# Altium schematic sheet CP_Scheme.SchDoc: Название платы
size 594 x 420 mm; ApprovedBy: Рогов; CheckedBy: Фамилия проверяющего; DrawnBy: Фамилия разработчика; DocumentNumber: Введите номер платы + Э3; SheetNumber: пусто если листов 1, иначе 1; SheetTotal: количество листов; Format: A2; DocumentType: тип схемы; Title1str: (вторая строка при необходимости); ImagePath: Введите номер платы
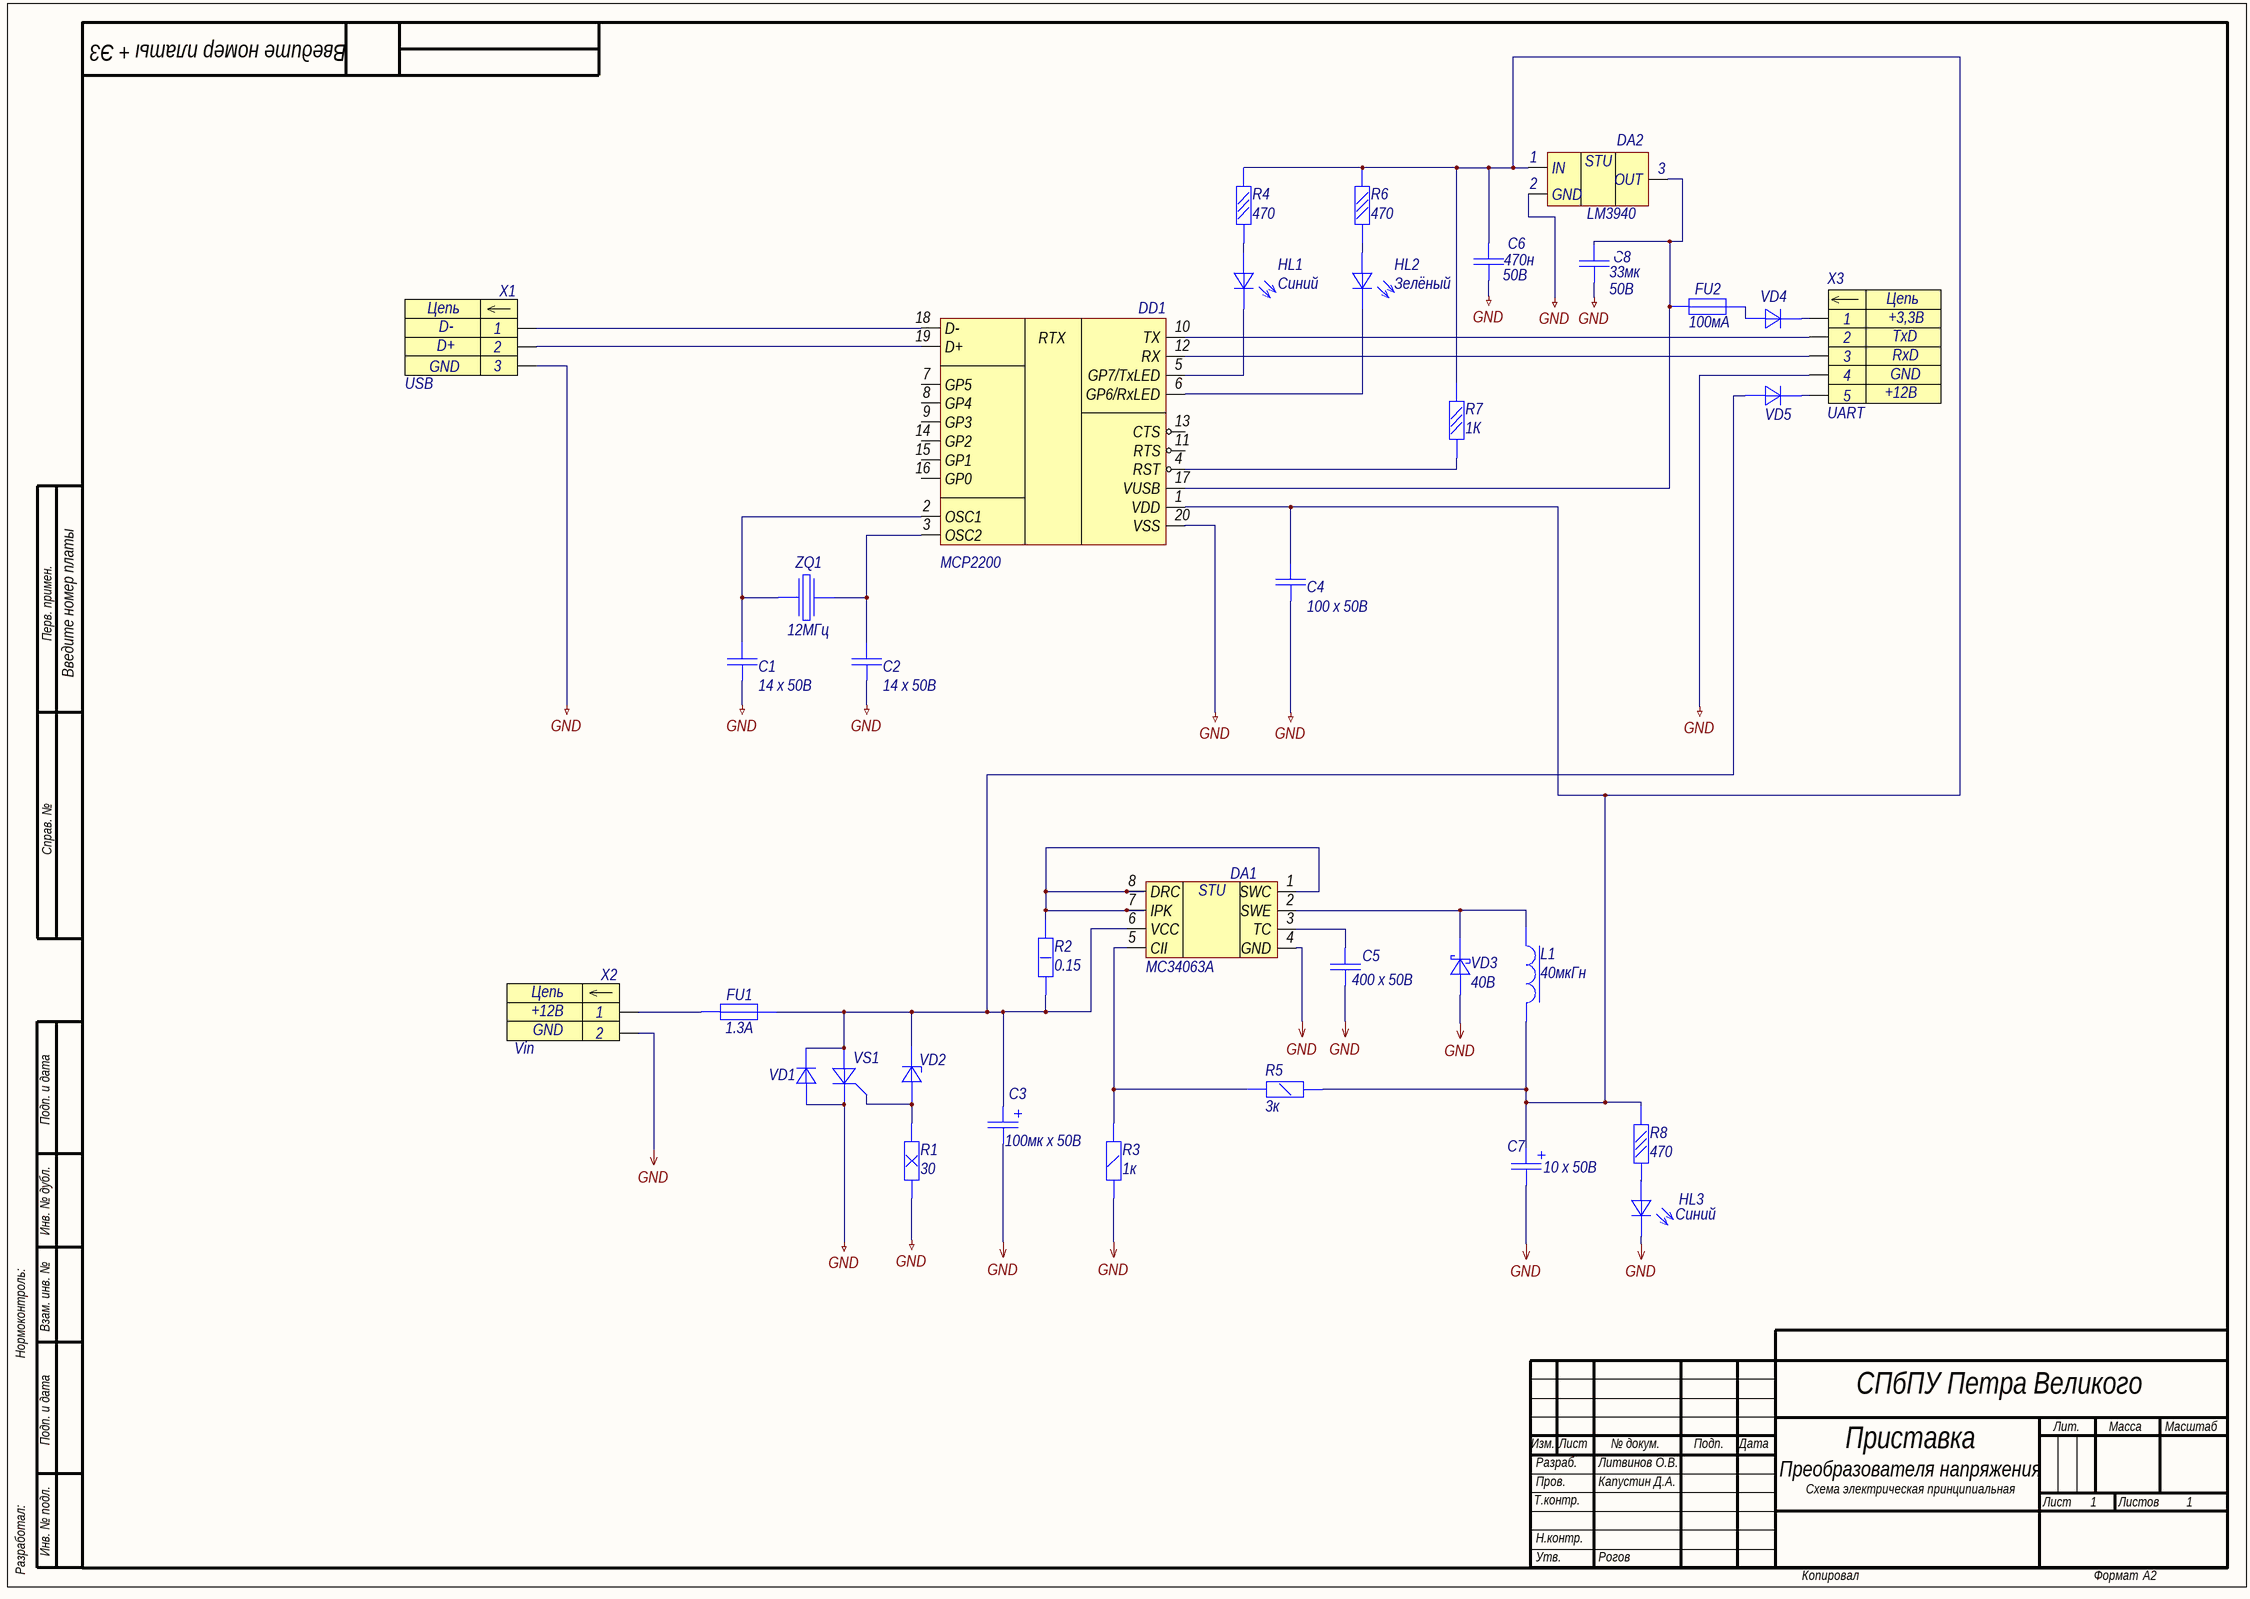
[diagram p0: CP_Scheme.SchDoc]

## Parts
C1  value 14 х 50В  [C0805]  (hidden comment: Capacitor)
C2  value 14 х 50В  [C0805]  (hidden comment: Capacitor)
C3  Ёмкость: 100мк х 50В  [C1206]  (hidden comment: Capacitor-E)
C4  value 100 х 50В  [C0805]  (hidden comment: Capacitor)
C5  Ёмкость: 400 х 50В  [R0805]  (hidden comment: Capacitor)
C6  value 470н  Voltage: 50В  [C0805]  (hidden comment: Capacitor)
C7  Ёмкость: 10 х 50В  [C1206]  (hidden comment: Capacitor-E)
C8  value 33мк  Voltage: 50В  [C0805]  (hidden comment: Capacitor)
DA1  MC34063A  [PCBComponent_1]
DA2  LM3940  [SOT95P237X112-3N]
DD1  MCP2200  WTF: RTX  [SOIC127P1030X265-20N]
FU1  value 1.3A  [F1812]  (hidden comment: Fuse)
FU2  value 100мA  [F1812]  (hidden comment: Fuse)
HL1  Цвет: Синий  [LD0805]  (hidden comment: LED_3V)
HL2  Цвет: Зелёный  [LD0805]  (hidden comment: LED_3V)
HL3  Цвет: Синий  [LD0805]  (hidden comment: LED_3V)
L1  value 40мкГн  [МДГ-2]  (hidden comment: Coil)
R1  Сопротивление: 30  [R0805]  (hidden comment: Resistor_10,0W)
R2  value 0.15  [R0805]  (hidden comment: Resistor_1,0W)
R3  value 1к  [R0805]  (hidden comment: Resistor_0,25W)
R4  Сопротивление: 470  [R0805]  (hidden comment: Resistor_0,05W)
R5  value 3к  [R0805]  (hidden comment: Resistor_0,25W)
R6  Сопротивление: 470  [R0805]  (hidden comment: Resistor_0,05W)
R7  value 1К  [R0805]  (hidden comment: Resistor_0,05W)
R8  Сопротивление: 470  [R0805]  (hidden comment: Resistor_0,05W)
VD1  Diode  [SOD-123]  (value not drawn)
VD2  Suppressor  [DO-214AA]  (value not drawn)
VD3  Максимальное обратное напряжение: 40В  [DO-214AC]  (hidden comment: Schottky)
VD4  Diode  [SOD-123]  (value not drawn)
VD5  Diode  [SOD-123]  (value not drawn)
VS1  tiristor  [SOT95P237X112-3N]  (value not drawn)
X1  USB  Out: D-  In: D+  [DS1099]
X2  Vin  U: +12В  [DJK-02-Series]
X3  UART  In: TxD  Out: RxD  U: +3,3В  [90136-1x05]
ZQ1  Частота: 12МГц  [HC-49SM]  (hidden comment: Crystal)

## Nets
GND: C1.1 C2.1 C3.2 C4.2 C5.1 C6.2 C7.2 C8.2 DA1.4(GND) DA2.2(GND) DD1.20(VSS) HL3.2(К) R1.1 R3.1 VD1.1(А) VD3.1(А) VS1.3(К) X1.3 X2.2 X3.4
NetC1_2: C1.2 DD1.2(OSC1) ZQ1.1
NetC2_2: C2.2 DD1.3(OSC2) ZQ1.3
NetC3_1: C3.1 DA1.6(VCC) FU1.2 R2.1 VD1.2(К) VD2.2(К) VD5.1(А) VS1.2(А)
NetC4_1: C4.1 C6.1 C7.1 DA2.1(IN) DD1.1(VDD) L1.2 R4.2 R5.2 R6.2 R7.2 R8.2
NetC5_2: C5.2 DA1.3(TC)
NetC8_1: C8.1 DA2.3(OUT) DD1.17(VUSB) FU2.1
NetDA1_1: DA1.1(SWC) DA1.7(IPK) DA1.8(DRC) R2.2
NetDA1_2: DA1.2(SWE) L1.1 VD3.2(К)
NetDA1_5: DA1.5(CII) R3.2 R5.1
NetDD1_4: DD1.4(RST) R7.1
NetDD1_5: DD1.5(GP7/TxLED) HL1.2(К)
NetDD1_6: DD1.6(GP6/RxLED) HL2.2(К)
NetDD1_10: DD1.10(TX) X3.2
NetDD1_12: DD1.12(RX) X3.3
NetDD1_18: DD1.18(D-) X1.1
NetDD1_19: DD1.19(D+) X1.2
NetFU1_1: FU1.1 X2.1
NetFU2_2: FU2.2 VD4.1(А)
NetHL1_1: HL1.1(А) R4.1
NetHL2_1: HL2.1(А) R6.1
NetHL3_1: HL3.1(А) R8.1
NetR1_2: R1.2 VD2.1(А) VS1.1(G)
NetVD4_2: VD4.2(К) X3.1
NetVD5_2: VD5.2(К) X3.5

Not connected (* = marked no-connect by the designer): DD1 7(GP5) 8(GP4) 9(GP3) 11(RTS) 13(CTS) 14(GP2) 15(GP1) 16(GP0)

## Notes on the sheet
- (near C8) +
- Перв. примен.
- Справ. №
- Подп. и дата
- Инв. № дубл.
- Нормоконтроль:
- Взам. инв. №
- СПбПУ Петра Великого
- Изм.
- Лист
- № докум.
- Подп.
- Дата
- Приставка
- Лит.
- Масса
- Масштаб
- Т.контр.
- Пров.
- Разраб.
- Капустин Д.А.
- Литвинов О.В.
- Преобразователя напряжения
- Схема электрическая принципиальная
- 1
- Листов
- Разработал:
- Инв. № подл.
- Н.контр.
- Утв.
- Копировал
- Формат
- (in symbol LM3940) STU
- (in symbol MC34063A) STU
- (in symbol UART_2) Цепь; +12В
- (in symbol USB_cut) Цепь
- (in symbol Vin) Цепь

## Library data of the parts
C1 C2 C4-C6 C8 = Capacitor: Type: Конденсатор
  C5: Published: 18.05.2010; Publisher: Andrew Danich
C3 C7 = Capacitor-E: Type: Конденсатор; Published: 20.08.2010; Publisher: Олег Литвинов
DD1 = MCP2200: Create: Litvinov
HL1 HL2 = Led-1: Type: Индикатор единичный; Прямое напряжение: 3В; Произв. номер: SMLE13EC8TT86; Прямой ток: 5мА; Published: 03.12.2013; Publisher: Andrew Danich
HL3 = Led-1: Type: Индикатор единичный; Прямое напряжение: 3.3В; Произв. номер: SMLE13EC8TT86; Прямой ток: 3мА; Published: 03.12.2013; Publisher: Andrew Danich
L1 = КИВ18-100: Manufacturer: ОАО "МСТАТОР"; Type: Дроссель; ID: 1; Rated Current: 185mA; Tolerance: ±10%; Q: 20; DC Resistance: 1.2ohm; Specification: КВШУ.670114.001 ТУ; Application Category: 5; Working Temperature Min: -60°С; Working Temperature Max: +85°С; Published: 20.05.2010; Publisher: Andrew Danich; Part Number: КИВ18-100; Footprint: 0603
VD1 VD4 VD5 = Diode: Type: Диод
VD2 = Suppressor: Type: Супрессор; Напряжение: 12В
VD3 = Schottky: BYV10-40; Type: Диод; Прямой ток: 1 А
X1 = USB_cut: Create: DeathSpeaker; GND: GND
X2 = Vin: Create: DeathSpeaker; Out: D-; In: D+; GND: GND
X3 = UART_2: Create: Litvinov; GND: GND
DA2 = LM3940: Item ID: LM3940
FU1 FU2 = Fuse: Type: Вставка плавкая
R1 = Resistor_10,0W: Type: Резистор
R2 = Resistor_1,0W: Type: Резистор
R3 R5 = Resistor_0,25W: Type: Резистор
R4 R6-R8 = Resistor_0,05W: Type: Резистор
ZQ1 = Crystal: Published: 08.03.2013; Publisher: Andrew Danich; Type: Резонатор